# EAGLE schematic turntable (EAGLE 7.6.0)
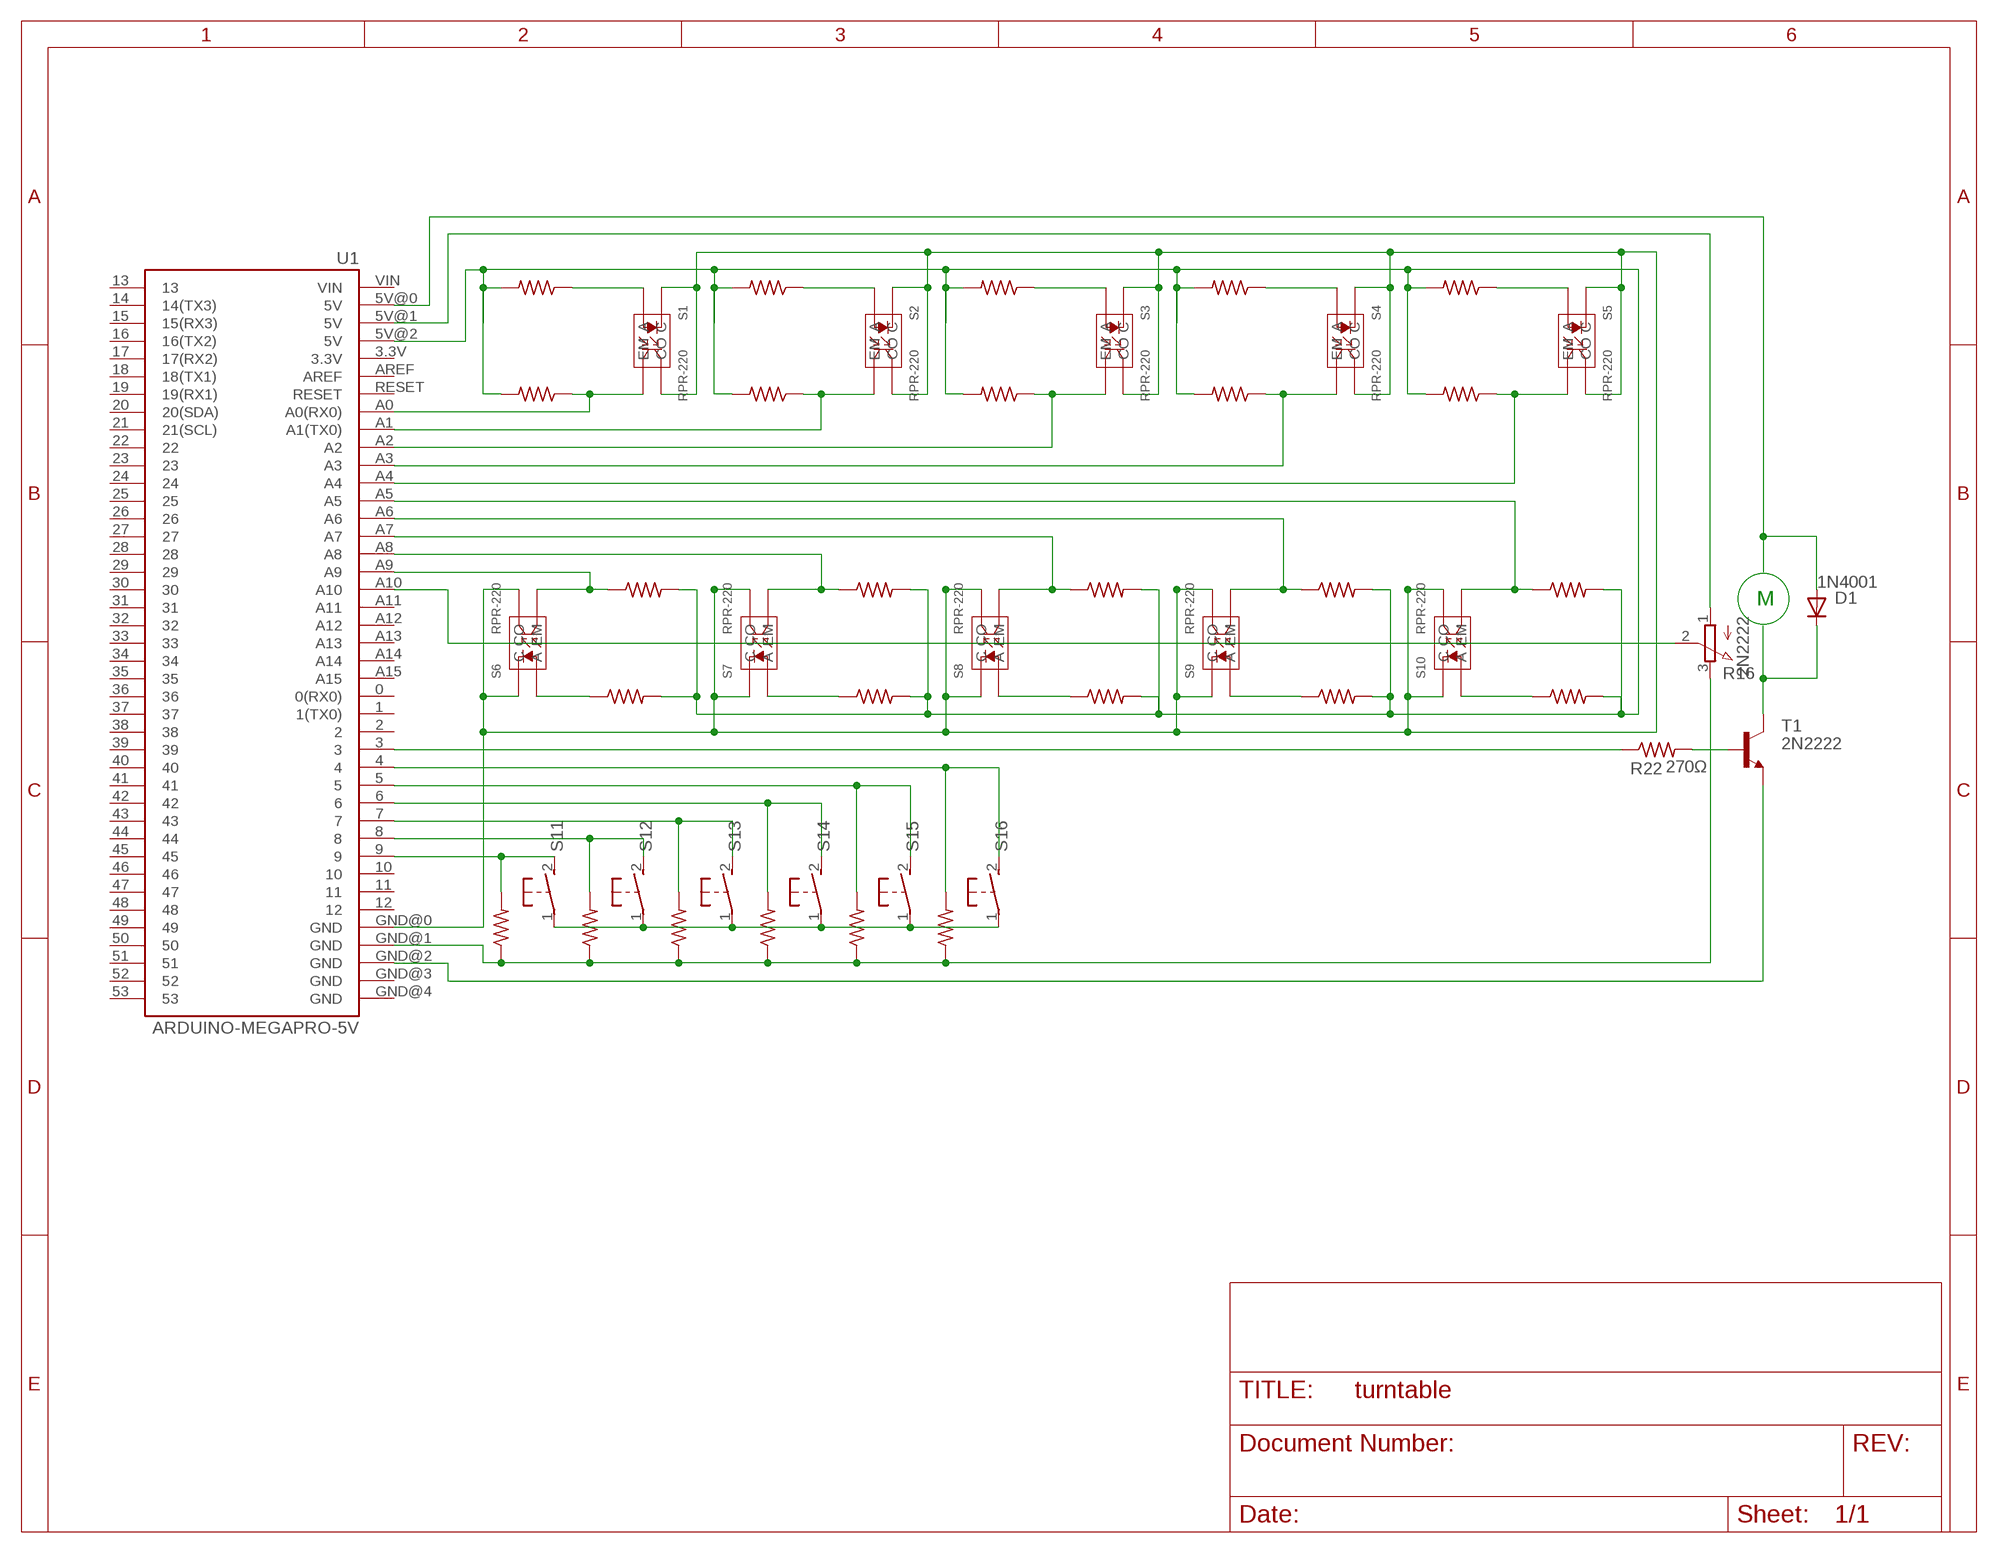
[diagram p0: schematic, sheet 1]

## Parts
D1  1N4001  1N4004  [DO41-10]
R1  270Ω  R-US_0204/2V  [0204V]
R2  270Ω  R-US_0204/2V  [0204V]
R3  270Ω  R-US_0204/2V  [0204V]
R4  270Ω  R-US_0204/2V  [0204V]
R5  270Ω  R-US_0204/2V  [0204V]
R6  270Ω  R-US_0204/2V  [0204V]
R7  270Ω  R-US_0204/2V  [0204V]
R8  270Ω  R-US_0204/2V  [0204V]
R9  270Ω  R-US_0204/2V  [0204V]
R10  270Ω  R-US_0204/2V  [0204V]
R11  270Ω  R-US_0204/2V  [0204V]
R12  270Ω  R-US_0204/2V  [0204V]
R13  270Ω  R-US_0204/2V  [0204V]
R14  270Ω  R-US_0204/2V  [0204V]
R15  270Ω  R-US_0204/2V  [0204V]
R16  2N2222  3RP/1610N  [3RP/1610N]
R17  270Ω  R-US_0204/2V  [0204V]
R18  270Ω  R-US_0204/2V  [0204V]
R19  270Ω  R-US_0204/2V  [0204V]
R20  270Ω  R-US_0204/2V  [0204V]
R21  270Ω  R-US_0204/2V  [0204V]
R22  270Ω  R-US_0204/2V  [0204V]
R23  270Ω  R-US_0204/2V  [0204V]
R24  270Ω  R-US_0204/2V  [0204V]
R25  270Ω  R-US_0204/2V  [0204V]
R26  270Ω  R-US_0204/2V  [0204V]
R27  270Ω  R-US_0204/2V  [0204V]
R28  270Ω  R-US_0204/2V  [0204V]
S1  RPR-220  OPTICAL-RPR-220(4P-6.4X4.9MM)  [SNR4-8.7X4.5X5.8MM]
S2  RPR-220  OPTICAL-RPR-220(4P-6.4X4.9MM)  [SNR4-8.7X4.5X5.8MM]
S3  RPR-220  OPTICAL-RPR-220(4P-6.4X4.9MM)  [SNR4-8.7X4.5X5.8MM]
S4  RPR-220  OPTICAL-RPR-220(4P-6.4X4.9MM)  [SNR4-8.7X4.5X5.8MM]
S5  RPR-220  OPTICAL-RPR-220(4P-6.4X4.9MM)  [SNR4-8.7X4.5X5.8MM]
S6  RPR-220  OPTICAL-RPR-220(4P-6.4X4.9MM)  [SNR4-8.7X4.5X5.8MM]
S7  RPR-220  OPTICAL-RPR-220(4P-6.4X4.9MM)  [SNR4-8.7X4.5X5.8MM]
S8  RPR-220  OPTICAL-RPR-220(4P-6.4X4.9MM)  [SNR4-8.7X4.5X5.8MM]
S9  RPR-220  OPTICAL-RPR-220(4P-6.4X4.9MM)  [SNR4-8.7X4.5X5.8MM]
S10  RPR-220  OPTICAL-RPR-220(4P-6.4X4.9MM)  [SNR4-8.7X4.5X5.8MM]
S11  31-XX  [B3F-31XX]
S12  31-XX  [B3F-31XX]
S13  31-XX  [B3F-31XX]
S14  31-XX  [B3F-31XX]
S15  31-XX  [B3F-31XX]
S16  31-XX  [B3F-31XX]
T1  2N2222  [TO92-EBC-OVAL]
U1  ARDUINO-MEGAPRO-5V  [ARDUINO_MEGA-PRO-5V]

## Nets
N$1: R28.2 S16.2(S) U1.4
N$2: R27.2 S15.2(S) U1.5
N$3: R26.2 S14.2(S) U1.6
N$4: R25.2 S13.2(S) U1.7
N$5: R11.1 S6.3(EM) U1.A9
N$6: R24.2 S12.2(S) U1.8
N$7: R23.2 S11.2(S) U1.9
N$8: R22.1 U1.3
N$9: R17.1 S6.1(A)
N$10: R1.2 R2.2 R3.2 R4.2 R5.2 R6.2 R7.2 R8.2 R9.2 R10.2 R11.2 R12.2 R13.2 R14.2 R15.2 R17.2 R18.2 R19.2 R20.2 R21.2 U1.5V@2(5V)
N$11: S1.2(C) S1.4(CO) S2.2(C) S2.4(CO) S3.2(C) S3.4(CO) S4.2(C) S4.4(CO) S5.2(C) S5.4(CO) S6.2(C) S6.4(CO) S7.2(C) S7.4(CO) S8.2(C) S8.4(CO) S9.2(C) S9.4(CO) S10.2(C) S10.4(CO) U1.GND@0(GND)
N$12: R12.1 S7.3(EM) U1.A8
N$13: R18.1 S7.1(A)
N$14: R22.2 T1.B
N$15: R4.1 S4.1(A)
N$16: R13.1 S8.3(EM) U1.A7
N$18: R16.1(A) U1.5V@1(5V)
N$19: T1.E U1.GND@2(GND)
N$20: R14.1 S9.3(EM) U1.A6
N$22: R16.3(E) R23.1 R24.1 R25.1 R26.1 R27.1 R28.1 U1.GND@1(GND)
N$24: R15.1 S10.3(EM) U1.A5
N$26: R19.1 S8.1(A)
N$28: R10.1 S5.3(EM) U1.A4
N$29: R5.1 S5.1(A)
N$31: D1.C T1.C
N$32: R9.1 S4.3(EM) U1.A3
N$34: D1.A U1.5V@0(5V)
N$35: R16.2(S) U1.A10
N$36: R8.1 S3.3(EM) U1.A2
N$38: R20.1 S9.1(A)
N$40: R7.1 S2.3(EM) U1.A1(A1(TX0))
N$44: R6.1 S1.3(EM) U1.A0(A0(RX0))
N$45: R3.1 S3.1(A)
N$48: R21.1 S10.1(A)
N$49: S11.1(P) S12.1(P) S13.1(P) S14.1(P) S15.1(P) S16.1(P)
N$57: R2.1 S2.1(A)
N$63: R1.1 S1.1(A)
Unconnected: U1.0(0(RX0)) U1.1(1(TX0)) U1.2 U1.3.3V U1.10 U1.11 U1.12 U1.13 U1.14(14(TX3)) U1.15(15(RX3)) U1.16(16(TX2)) U1.17(17(RX2)) U1.18(18(TX1)) U1.19(19(RX1)) U1.20(20(SDA)) U1.21(21(SCL)) U1.22 U1.23 U1.24 U1.25 U1.26 U1.27 U1.28 U1.29 U1.30 U1.31 U1.32 U1.33 U1.34 U1.35 U1.36 U1.37 U1.38 U1.39 U1.40 U1.41 U1.42 U1.43 U1.44 U1.45 U1.46 U1.47 U1.48 U1.49 U1.50 U1.51 U1.52 U1.53 U1.A11 U1.A12 U1.A13 U1.A14 U1.A15 U1.AREF U1.GND@3(GND) U1.GND@4(GND) U1.RESET U1.VIN

## Notes on the sheet
- M

## Library data of the parts
D1 = diode:1N4004: DIODE general purpose rectifier, 1 A
R1-R15 R17-R28 = resistor:R-US_: RESISTOR, American symbol
R16 = pot:3RP/1610N: 16mm Potentiometer one level Source: http://www.alphapotentiometers.net/html/16mm_pot_2.html
S1-S10 = rpr-220:OPTICAL-RPR-220(4P-6.4X4.9MM): 314020002; AVAILABILITY: Good; DESCRIPTION: General Size 50 mA 30 V 800 nm Through Hole Reflective Photosensor; MF: Rohm; MP: RPR-220; PACKAGE: DIP-4 Rohm; PRICE: 1.14 USD
S11-S16 = adafruit:31-XX: OMRON SWITCH Now with beefier pads!
T1 = adafruit:2N2222: NPN TRANSISTOR Big oval pads
U1 = SparkFun-Boards:ARDUINO-MEGA: Arduino Mega board footprint